# EAGLE design io_dac_convert (EAGLE 7.7.0)
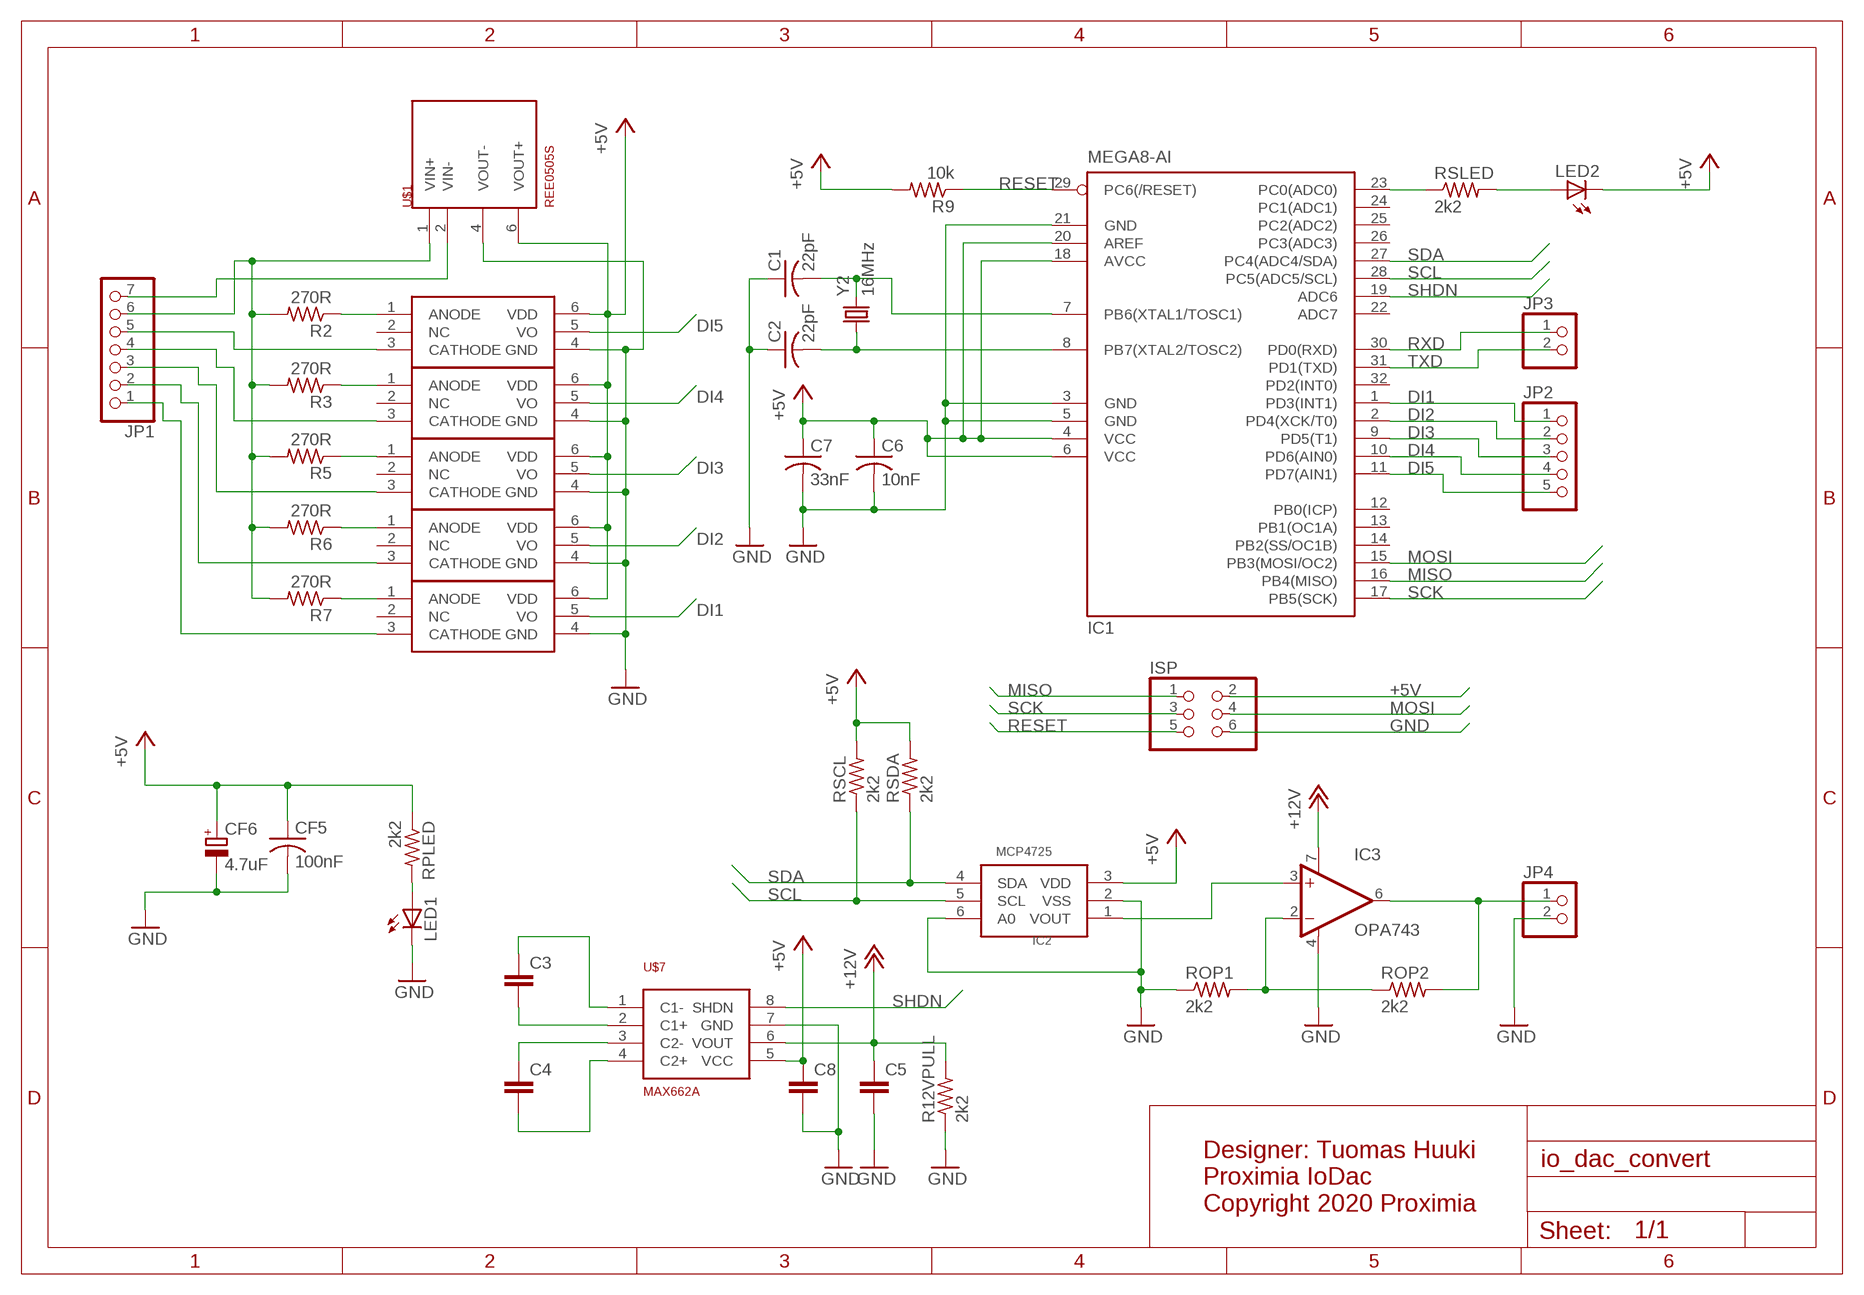
[diagram p0: schematic, sheet 1]

## Parts
C1  22pF  C-USC0603  [C0603]
C2  22pF  C-USC0603  [C0603]
C3  C-EUC1206  [C1206]
C4  C-EUC1206  [C1206]
C5  C-EUC1206  [C1206]
C6  10nF  C-USC0603  [C0603]
C7  33nF  C-USC0603  [C0603]
C8  C-EUC1206  [C1206]
CF5  100nF  C-USC0603  [C0603]
CF6  4.7uF  CPOL-EUB  [PANASONIC_B]
IC1  MEGA8-AI  [TQFP32-08]
IC2  MCP4725  [SOT23-6]
IC3  OPA743  OPA658U  [SO08]
ISP  PINHD-2X3  [2X03]
JP1  PINHD-1X7  [1X07]
JP2  PINHD-1X5  [1X05]
JP3  PINHD-1X2  [1X02]
JP4  PINHD-1X2  [1X02]
LED1  LEDSML1206  [SML1206]
LED2  LEDSML1206  [SML1206]
R2  270R  R-US_R0603  [R0603]
R3  270R  R-US_R0603  [R0603]
R5  270R  R-US_R0603  [R0603]
R6  270R  R-US_R0603  [R0603]
R7  270R  R-US_R0603  [R0603]
R9  10k  R-US_R0603  [R0603]
R12VPULL  2k2  R-US_R0603  [R0603]
ROP1  2k2  R-US_R0603  [R0603]
ROP2  2k2  R-US_R0603  [R0603]
RPLED  2k2  R-US_R0603  [R0603]
RSCL  2k2  R-US_R0603  [R0603]
RSDA  2k2  R-US_R0603  [R0603]
RSLED  2k2  R-US_R0603  [R0603]
U$1  REE0505S  [SIP-6]
U$2  SI8710  [SDIP-6]
U$3  SI8710  [SDIP-6]
U$4  SI8710  [SDIP-6]
U$5  SI8710  [SDIP-6]
U$6  SI8710  [SDIP-6]
U$7  MAX662A  [SO8]
Y2  16MHz  CRYSTAL5X3  [CRYSTAL-SMD-5X3]

## Nets
+5V: C6.1 C7.1 C8.1 CF5.1 CF6.+ IC1.4(VCC) IC1.6(VCC) IC1.18(AVCC) IC1.20(AREF) IC2.3(VDD) ISP.2 LED2.C R9.2 RPLED.1 RSCL.2 RSDA.2 U$1.6(VOUT+) U$2.6(VDD) U$3.6(VDD) U$4.6(VDD) U$5.6(VDD) U$6.6(VDD) U$7.5(VCC)
+12V: C5.1 IC3.7(V+) R12VPULL.2 U$7.6(VOUT)
DI1: IC1.1(PD3(INT1)) JP2.1 U$6.5(VO)
DI2: IC1.2(PD4(XCK/T0)) JP2.2 U$5.5(VO)
DI3: IC1.9(PD5(T1)) JP2.3 U$4.5(VO)
DI4: IC1.10(PD6(AIN0)) JP2.4 U$3.5(VO)
DI5: IC1.11(PD7(AIN1)) JP2.5 U$2.5(VO)
GND: C1.1 C2.1 C5.2 C6.2 C7.2 C8.2 CF5.2 CF6.- IC1.3(GND) IC1.5(GND) IC1.21(GND) IC2.2(VSS) IC2.6(A0) IC3.4(V-) ISP.6 JP4.2 LED1.C R12VPULL.1 ROP1.1 U$1.4(VOUT-) U$2.4(GND) U$3.4(GND) U$4.4(GND) U$5.4(GND) U$6.4(GND) U$7.7(GND)
GND_EXT: JP1.7 U$1.2(VIN-)
MISO: IC1.16(PB4(MISO)) ISP.1
MOSI: IC1.15(PB3(MOSI/OC2)) ISP.4
N$1: LED1.A RPLED.2
N$3: IC1.23(PC0(ADC0)) RSLED.1
N$4: JP1.6 R2.2 R3.2 R5.2 R6.2 R7.2 U$1.1(VIN+)
N$5: R2.1 U$2.1(ANODE)
N$6: JP1.5 U$2.3(CATHODE)
N$7: R3.1 U$3.1(ANODE)
N$8: R5.1 U$4.1(ANODE)
N$9: R6.1 U$5.1(ANODE)
N$10: R7.1 U$6.1(ANODE)
N$11: JP1.4 U$3.3(CATHODE)
N$12: JP1.3 U$4.3(CATHODE)
N$13: JP1.2 U$5.3(CATHODE)
N$14: JP1.1 U$6.3(CATHODE)
N$15: C2.2 IC1.8(PB7(XTAL2/TOSC2)) Y2.1
N$16: C1.2 IC1.7(PB6(XTAL1/TOSC1)) Y2.3
N$17: C3.2 U$7.2(C1+)
N$18: IC2.1(VOUT) IC3.3(+IN)
N$19: IC3.6(OUT) JP4.1 ROP2.2
N$20: IC3.2(-IN) ROP1.2 ROP2.1
N$21: C3.1 U$7.1(C1-)
N$22: LED2.A RSLED.2
N$23: C4.1 U$7.3(C2-)
N$24: C4.2 U$7.4(C2+)
RESET: IC1.29(PC6(/RESET)) ISP.5 R9.1
RXD: IC1.30(PD0(RXD)) JP3.1
SCK: IC1.17(PB5(SCK)) ISP.3
SCL: IC1.28(PC5(ADC5/SCL)) IC2.5(SCL) RSCL.1
SDA: IC1.27(PC4(ADC4/SDA)) IC2.4(SDA) RSDA.1
SHDN: IC1.19(ADC6) U$7.8(SHDN)
TXD: IC1.31(PD1(TXD)) JP3.2
Unconnected: IC1.12(PB0(ICP)) IC1.13(PB1(OC1A)) IC1.14(PB2(SS/OC1B)) IC1.22(ADC7) IC1.24(PC1(ADC1)) IC1.25(PC2(ADC2)) IC1.26(PC3(ADC3)) IC1.32(PD2(INT0)) U$2.2(NC) U$3.2(NC) U$4.2(NC) U$5.2(NC) U$6.2(NC)

## Notes on the sheet
- Designer: Tuomas Huuki 
  Proximia IoDac
  Copyright 2020 Proximia

## Library data of the parts
C1 C2 CF5 = rcl:C-US: CAPACITOR, American symbol
C3-C5 C8 = rcl:C-EU: CAPACITOR, European symbol
C6 C7 = resistor:C-US: CAPACITOR, American symbol
CF6 = resistor:CPOL-EU: POLARIZED CAPACITOR, European symbol
IC1 = atmel:MEGA8: MICROCONTROLLER 8 Kbytes FLASH, 1 kbytes SRAM, 512 bytes EEPROM, USART, 6-channel 10 bit ADC, 2-channel 8 bit ADC Pin compatible with Atmega48, ATMega88, ATMega168 Source: avr.lbr; MPN: ATMEGA8-16AU; OC_FARNELL: 9171371; OC_NEWARK: 73M8863
IC2 = microchip-update:MCP4725: 12-Bit Digital-to-Analog Converter with EEPROM Memory in SOT-23-6
IC3 = burr-brown:OPA658: Operational Amplifier Wideband, Low Power, Current Feedback; MPN: AD8001ARZ; OC_FARNELL: unknown; OC_NEWARK: 19M0912
ISP = pinhead:PINHD-2X3: PIN HEADER
JP1 = pinhead:PINHD-1X7: PIN HEADER
JP2 = pinhead:PINHD-1X5: PIN HEADER
JP3 JP4 = pinhead:PINHD-1X2: PIN HEADER
LED1 LED2 = led:LED: LED OSRAM: - CHIPLED LG R971, LG N971, LY N971, LG Q971, LY Q971, LO R971, LY R971 LH N974, LH R974 LS Q976, LO Q976, LY Q976 LO Q996 - Hyper CHIPLED LW Q18S LB Q993, LB Q99A, LB R99A - SideLED LS A670, LO A670, LY A670, LG A670, LP A670 LB A673, LV A673, LT A673, LW A673 LH A674 LY A675 LS A676, LA A676, LO A676, LY A676, LW A676 LS A679, LY A679, LG A679 - Hyper Micro SIDELED® LS Y876, LA Y876, LO Y876, LY Y876 LT Y87S - SmartLED LW L88C, LW L88S LB L89C, LB L89S, LG L890 LS L89K, LO L89K, LY L89K LS L896, LA L896, LO L896, LY L896 - TOPLED LS T670, LO T670, LY T670, LG T670, LP T670 LSG T670, LSP T670, LSY T670, LOP T670, LYG T670 LG T671, LOG T671, LSG T671 LB T673, LV T673, LT T673, LW T673 LH T674 LS T676, LA T676, LO T676, LY T676, LB T676, LH T676, LSB T676, LW T676 LB T67C, LV T67C, LT T67C, LS T67K, LO T67K, LY T67K, LW E67C LS E67B, LA E67B, LO E67B, LY E67B, LB E67C, LV E67C, LT E67C LW T67C LS T679, LY T679, LG T679 LS T770, LO T770, LY T770, LG T770, LP T770 LB T773, LV T773, LT T773, LW T773 LH T774 LS E675, LA E675, LY E675, LS T675 LS T776, LA T776, LO T776, LY T776, LB T776 LHGB T686 LT T68C, LB T68C - Hyper Mini TOPLED® LB M676 - Mini TOPLED Santana® LG M470 LS M47K, LO M47K, LY M47K Source: http://www.osram.convergy.de LUXEON: - LUMILED® LXK2-PW12-R00, LXK2-PW12-S00, LXK2-PW14-U00, LXK2-PW14-V00 LXK2-PM12-R00, LXK2-PM12-S00, LXK2-PM14-U00 LXK2-PE12-Q00, LXK2-PE12-R00, LXK2-PE12-S00, LXK2-PE14-T00, LXK2-PE14-U00 LXK2-PB12-K00, LXK2-PB12-L00, LXK2-PB12-M00, LXK2-PB14-N00, LXK2-PB14-P00, LXK2-PB14-Q00 LXK2-PR12-L00, LXK2-PR12-M00, LXK2-PR14-Q00, LXK2-PR14-R00 LXK2-PD12-Q00, LXK2-PD12-R00, LXK2-PD12-S00 LXK2-PH12-R00, LXK2-PH12-S00 LXK2-PL12-P00, LXK2-PL12-Q00, LXK2-PL12-R00 Source: www.luxeon.com KINGBRIGHT: KA-3528ASYC Source: www.kingbright.com
R2 R3 R5-R7 R12VPULL ROP1 ROP2 RPLED RSCL RSDA RSLED = rcl:R-US_: RESISTOR, American symbol
R9 = resistor:R-US_: RESISTOR, American symbol
U$1 = REE:REE0505S
U$2-U$6 = REE:SI8710
U$7 = REE:MAX662A
Y2 = SparkFun-FreqCtrl:CRYSTAL: Various standard crystals. Proven footprints. Spark Fun Electronics SKU : COM-00534

## Board
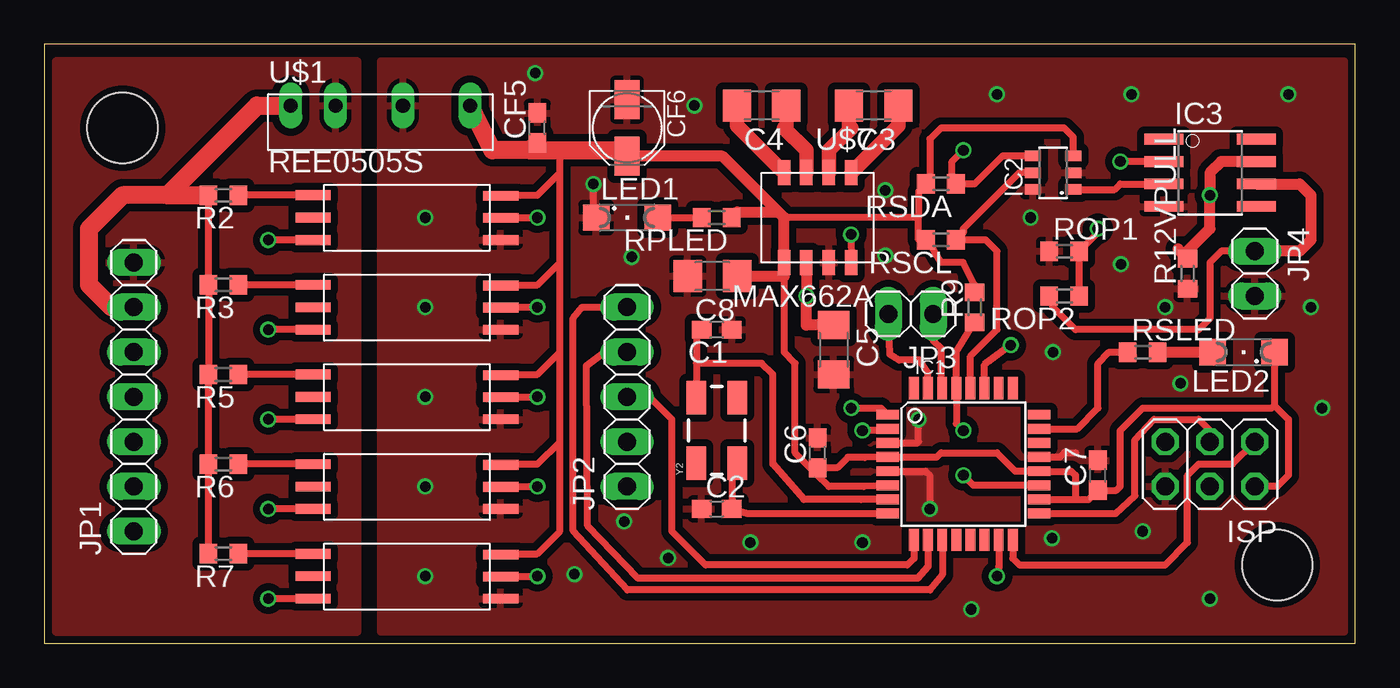
[diagram p1: board, top side]
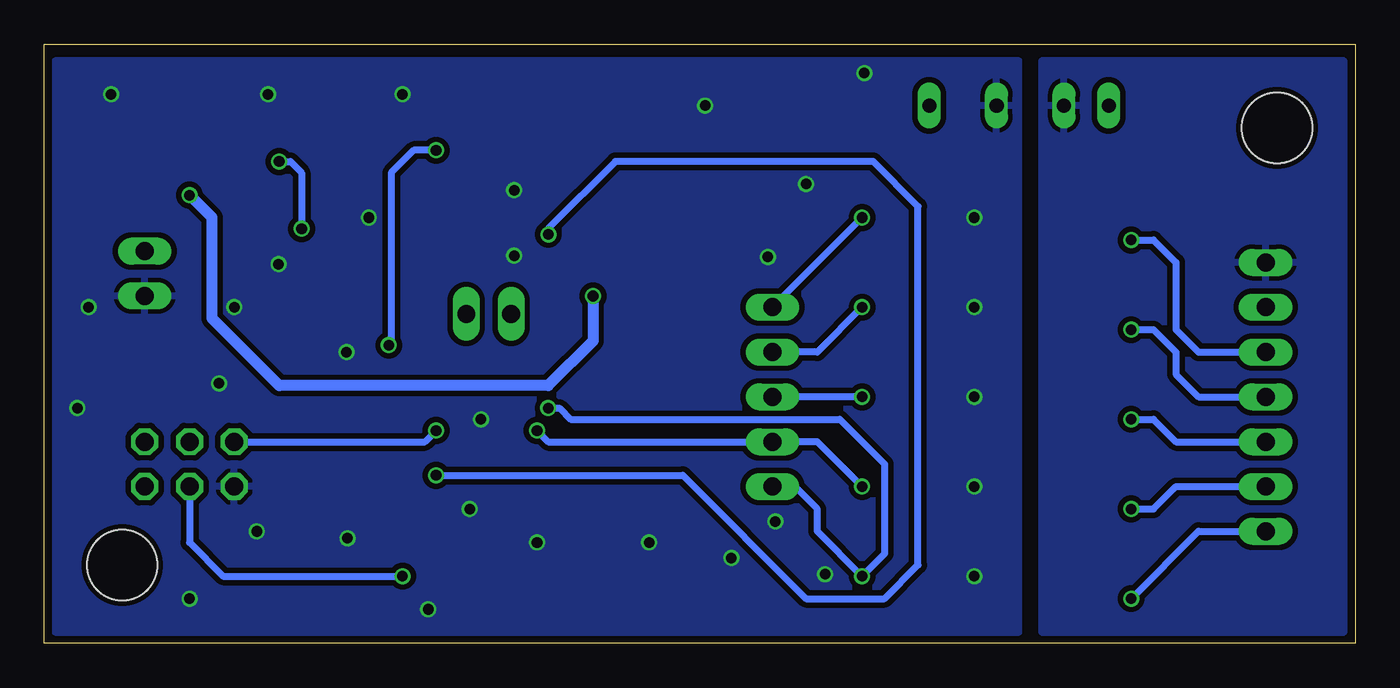
[diagram p2: board, bottom side, seen from below]

Size 74.28 x 33.96 mm. Coordinates in mm from the lower left corner, seen from the top.
Outline: 0,0 74.28,0 74.28,33.96 0,33.96 0,0
Copper layers (1*16): Top 0.035mm / dielectric 1.5mm / Bottom 0.035mm
Design rules "ITeadstudio": minimum track width 6mil, minimum drill 12mil, track to track 6mil, track to pad 6mil, pad to pad 6mil, via to via 6mil, smd to smd 0mil, copper to edge 10mil, drill to drill 10mil, minimum pad ring 10mil, minimum via ring 6mil, stop-mask expansion 2mil, vias tented up to drill 100mil, thermal gap 10mil
Holes 4 mm at 4.45,29.21 69.85,4.45

### Footprints (pad centres in the part's own frame; a part is rotated, then mirrored left to right if it is on the bottom)
C0603 = smd 1.1 x 1: 1 -0.85,0; 2 0.85,0
C1206 = smd 1.6 x 1.8: 1 -1.4,0; 2 1.4,0
PANASONIC_B = smd 2.2 x 1.4: + 1.6,0; - -1.6,0
TQFP32-08 = smd 1.27 x 0.559: 1 -4.293,2.8; 2 -4.293,2; 3 -4.293,1.2; 4 -4.293,0.4; 5 -4.293,-0.4; 6 -4.293,-1.2; 7 -4.293,-2; 8 -4.293,-2.8; 17 4.293,-2.8; 18 4.293,-2; 19 4.293,-1.2; 20 4.293,-0.4; 21 4.293,0.4; 22 4.293,1.2; 23 4.293,2; 24 4.293,2.8 | smd 0.559 x 1.27: 9 -2.8,-4.293; 10 -2,-4.293; 11 -1.2,-4.293; 12 -0.4,-4.293; 13 0.4,-4.293; 14 1.2,-4.293; 15 2,-4.293; 16 2.8,-4.293; 25 2.8,4.293; 26 2,4.293; 27 1.2,4.293; 28 0.4,4.293; 29 -0.4,4.293; 30 -1.2,4.293; 31 -2,4.293; 32 -2.8,4.293
SOT23-6 = smd 0.6 x 0.9: 1 -0.95,-1.15; 2 0,-1.15; 3 0.95,-1.15; 4 0.95,1.15; 5 0,1.15; 6 -0.95,1.15
SO08 = smd 0.61 x 2.21: 1 -1.905,-2.616; 2 -0.635,-2.616; 3 0.635,-2.616; 4 1.905,-2.616; 5 1.905,2.616; 6 0.635,2.616; 7 -0.635,2.616; 8 -1.905,2.616
2X03 = drill 1.016 octagon: 1 -2.54,-1.27; 2 -2.54,1.27; 3 0,-1.27; 4 0,1.27; 5 2.54,-1.27; 6 2.54,1.27
1X07 = drill 1.016 long: 1 -7.62,0; 2 -5.08,0; 3 -2.54,0; 4 0,0; 5 2.54,0; 6 5.08,0; 7 7.62,0
1X05 = drill 1.016 long: 1 -5.08,0; 2 -2.54,0; 3 0,0; 4 2.54,0; 5 5.08,0
1X02 = drill 1.016 long: 1 -1.27,0; 2 1.27,0
SML1206 = smd 1.5 x 1.5: A 1.75,0; C -1.75,0
R0603 = smd 1 x 1.1: 1 -0.85,0; 2 0.85,0
SIP-6 = drill 0.8 long: 1 0,0; 2 2.54,0; 4 6.35,0; 6 10.16,0
SDIP-6 = smd 2 x 0.55: 1 0,2.54; 2 0,1.27; 3 0,0; 4 10.625,0; 5 10.625,1.25; 6 10.625,2.5
SO8 = smd 0.711 x 1.422: 1 0,0; 2 1.27,0; 3 2.54,0; 4 3.81,0; 5 3.81,5.08; 6 2.54,5.08; 7 1.27,5.08; 8 0,5.08
CRYSTAL-SMD-5X3 = smd 1.9 x 1.1: 1 -1.85,-1.15; 2 1.85,-1.15; 3 1.85,1.15; 4 -1.85,1.15

### Placement (x,y rotation side)
C1  38.1,17.78 180 top
C2  38.1,7.62 0 top
C3  46.99,30.48 180 top
C4  40.64,30.48 180 top
C5  44.72,16.64 270 top
C6  43.81,10.79 90 top
C7  59.69,9.53 90 top
C8  37.85,20.81 180 top
CF5  27.94,29.21 90 top
CF6  33.02,29.21 270 top
IC1  52.07,10.16 0 top
IC2  57.15,26.67 90 top
IC3  66.04,26.67 270 top
ISP  66.04,10.16 180 top
JP1  5.08,13.97 90 top
JP2  33.02,13.97 90 top
JP3  49.09,18.68 180 top
JP4  68.58,20.95 270 top
LED1  33.02,24.13 0 top
LED2  67.94,16.51 180 top
R2  10.16,25.4 180 top
R3  10.16,20.32 180 top
R5  10.16,15.24 180 top
R6  10.16,10.16 180 top
R7  10.16,5.08 180 top
R9  52.7,19.05 90 top
R12VPULL  64.77,20.95 90 top
ROP1  57.78,22.23 0 top
ROP2  57.78,19.68 180 top
RPLED  38.1,24.13 180 top
RSCL  50.8,22.86 180 top
RSDA  50.8,26.04 180 top
RSLED  62.23,16.51 0 top
U$1  13.97,30.48 0 top
U$2  15.24,22.86 0 top
U$3  15.24,17.78 0 top
U$4  15.24,12.7 0 top
U$5  15.24,7.62 0 top
U$6  15.24,2.54 0 top
U$7  45.72,26.67 180 top
Y2  38.1,12.06 90 top

### Tracks (layer width: path | path; a pad name or v marks a point on that pad's centre or on a via)
+5V
  Top 0.406: 29.21,26.67 27.94,25.4 25.91,25.4 U$2.6 | 29.21,26.67 29.21,27.94 | U$3.6 25.91,20.32 27.94,20.32 29.21,21.59 | 29.21,21.59 29.21,26.67 | U$4.6 25.91,15.24 27.94,15.24 29.21,16.51 | 29.21,16.51 29.21,21.59 | U$5.6 25.91,10.16 27.94,10.16 29.21,11.43 | 29.21,11.43 29.21,16.51 | U$6.6 25.91,5.08 27.94,5.08 29.21,6.35 29.21,11.43 | 49.53,24.13 49.53,25.61 RSDA.2 50.16,26.25 50.16,28.57 50.8,29.21 57.78,29.21 58.3,28.7 IC2.3 | 50.16,22.86 RSCL.2 | RSCL.2 49.53,22.86 49.53,24.13 | 49.53,24.13 41.91,24.13 | 43.81,9.53 C6.1 | IC1.6 46.44,8.89 44.45,8.89 43.81,9.53 | 43.81,10.16 C6.1 | 43.81,9.53 42.55,10.79 42.55,15.88 41.91,16.51 U$7.5 | C6.1 44.94,9.96 45.53,10.55 46.49,10.54 IC1.4 50.56,10.56 50.8,10.79 53.98,10.79 55.01,9.76 IC1.20 58.19,9.76 58.42,9.53 58.42,8.16 | R9.2 52.7,20.32 52.07,21.59 50.8,21.59 50.16,22.64 RSCL.2 | IC1.18 58.42,8.16 | 58.42,8.16 59.17,8.16 C7.1 60.74,8.68 60.96,8.89 60.96,12.06 62.23,13.34 69.54,13.34 69.69,13.49 | LED2.C 69.69,13.49 | 69.69,13.49 70.48,12.7 70.48,9.53 69.85,8.89 ISP.2
  Top 0.61: 41.59,24.45 41.91,24.13 U$7.5 41.91,20.81 C8.1 | 41.59,24.45 38.43,27.61 CF6.+ | RPLED.1 39.27,24.45 41.59,24.45
  Top 1.016: CF5.1 27.52,27.94 | 27.52,27.94 25.4,27.94 U$1.6 | 27.52,27.94 29.21,27.94 33.02,27.94 CF6.+
+12V  (via drill 0.6)
  Top 0.61: U$7.6 v43.18,19.68 43.18,18.04 C5.1 | IC3.7 66.67,27.3 66.04,26.67 v66.04,25.4 66.04,23.5 64.77,22.23 R12VPULL.2 64.22,22.36
  Bottom 0.61: v43.18,19.68 43.18,17.14 45.72,14.61 60.96,14.61 64.77,18.41 64.77,24.13 v66.04,25.4
DI1  (via drill 0.6)
  Top 0.406: U$6.5 25.89,3.81 v27.94,3.81 | v45.72,13.34 47.4,13.34 IC1.1
  Bottom 0.406: JP2.1 31.75,8.89 30.48,7.62 30.48,6.35 v27.94,3.81 26.67,5.08 26.67,10.16 29.21,12.7 44.45,12.7 45.09,13.34 v45.72,13.34
DI2  (via drill 0.6)
  Top 0.406: U$5.5 25.89,8.89 v27.94,8.89 | IC1.2 47.68,12.06 v46.35,12.06
  Bottom 0.406: v27.94,8.89 30.48,11.43 JP2.2 45.72,11.43 v46.35,12.06
DI3  (via drill 0.6)
  Top 0.406: U$4.5 25.89,13.97 v27.94,13.97 | JP2.3 34.29,13.97 35.56,12.7 35.56,6.35 37.47,4.45 48.9,4.45 49.27,4.82 IC1.9
  Bottom 0.406: v27.94,13.97 JP2.3
DI4  (via drill 0.6)
  Top 0.406: U$3.5 25.89,19.05 v27.94,19.05 | IC1.10 50.07,4.35 49.51,3.69 33.63,3.69 30.8,6.67 30.71,15.74 31.75,16.51 JP2.4
  Bottom 0.406: v27.94,19.05 30.48,16.51 JP2.4
DI5  (via drill 0.6)
  Top 0.406: U$2.5 25.89,24.13 v27.94,24.13 | IC1.11 50.87,3.88 50.19,3.03 33.04,3.03 29.97,6.37 29.97,18.44 30.48,19.05 JP2.5
  Bottom 0.406: v27.94,24.13 JP2.5
GND  (via drill 0.6)
  Top 0.406: LED1.C 31.11,24.29 v31.11,26.04 | IC1.3 49.46,11.36 49.53,11.43 v49.53,12.7 | IC1.5 49.93,9.76 50.16,9.53 v50.16,7.62 | IC1.21 57.55,10.56 57.78,10.79 58.42,10.79
  other vias: 46.35,5.71 40.01,5.71 57.15,16.51 55.88,24.13 71.75,19.05 72.39,13.34 62.23,6.35 66.04,2.54 61.59,31.11 53.98,31.11 70.48,31.11 36.83,30.48 21.59,24.13 21.59,19.05 21.59,13.97 21.59,8.89 21.59,3.81 63.5,19.05 47.65,25.68 47.65,21.97 33.28,21.9 32.85,6.9 35.35,4.84 30.04,3.92 52.51,1.93 57.1,5.96 64.37,14.74 27.82,32.33 61,21.49
  pour Top (isolate 0.406): 19.05,33.02 73.66,33.02 73.66,0.64 19.05,0.64 19.05,32.38
  pour Bottom (isolate 0.305): 19.05,33.02 73.66,33.02 73.66,0.64 19.05,0.64
GND_EXT
  pour Top (isolate 0.406): 17.78,33.02 0.64,33.02 0.64,0.64 17.78,0.64
  pour Bottom (isolate 0.305): 0.64,33.02 17.78,33.02 17.78,0.64 0.64,0.64
MISO
  Top 0.406: IC1.16 54.87,4.82 55.24,4.45 63.5,4.45 64.77,5.71 64.77,9.53 65.41,10.16 67.31,10.16 ISP.1
MOSI  (via drill 0.6)
  Top 0.406: IC1.15 54.07,4.35 v53.98,3.81
  Bottom 0.406: ISP.4 66.04,5.71 64.14,3.81 v53.98,3.81
N$1
  Top 0.406: LED1.A RPLED.2
N$3
  Top 0.406: IC1.23 58.52,12.16 59.69,13.34 59.69,15.88 60.33,16.51 RSLED.1
  Top 0.61: 61.59,16.3 RSLED.1
N$4
  Top 0.406: R7.2 R6.2 R5.2 R3.2 R2.2
  Top 1.016: JP1.6 3.81,19.05 2.54,20.32 2.54,23.5 4.45,25.4 6.99,25.4 | 6.99,25.4 12.06,30.48 U$1.1 | 6.99,25.4 R2.2
N$5
  Top 0.406: U$2.1 R2.1
N$6  (via drill 0.6)
  Top 0.406: U$2.3 v12.7,22.86
  Bottom 0.406: v12.7,22.86 11.43,22.86 10.16,21.59 10.16,17.78 8.89,16.51 JP1.5
N$7
  Top 0.406: U$3.1 R3.1
N$8
  Top 0.406: U$4.1 R5.1
N$9
  Top 0.406: U$5.1 R6.1
N$10
  Top 0.406: U$6.1 R7.1
N$11  (via drill 0.6)
  Top 0.406: U$3.3 v12.7,17.78
  Bottom 0.406: v12.7,17.78 11.43,17.78 10.16,16.51 10.16,15.24 8.89,13.97 JP1.4
N$12  (via drill 0.6)
  Top 0.406: U$4.3 v12.7,12.7
  Bottom 0.406: v12.7,12.7 11.43,12.7 10.16,11.43 JP1.3
N$13  (via drill 0.6)
  Top 0.406: U$5.3 v12.7,7.62
  Bottom 0.406: v12.7,7.62 11.43,7.62 10.16,8.89 JP1.2
N$14  (via drill 0.6)
  Top 0.406: U$6.3 v12.7,2.54
  Bottom 0.406: v12.7,2.54 8.89,6.35 JP1.1
N$15
  Top 0.406: Y2.1 38.95,9.91 C2.2 39.84,7.36 IC1.8
N$16
  Top 0.406: C1.2 36.95,17.48 36.95,15.88 | 36.95,15.88 Y2.3 | IC1.7 46.27,8.15 43.04,8.15 41.27,10.16 41.27,15.24 40.64,15.88 36.95,15.88
N$17
  Top 0.813: U$7.2 44.45,27.94 45.72,29.21 45.59,29.34 C3.2
N$18
  Top 0.406: IC2.1 60.65,25.72 60.96,26.04 IC3.3
N$19
  Top 0.406: JP4.1 66.67,22.23 66.04,21.59 66.04,18.41 65.41,17.78 58.42,17.78 57.15,19.05 57.15,19.47 ROP2.2
  Top 0.61: IC3.6 71.12,26.04 71.75,25.4 71.75,22.86 71.12,22.23 JP4.1
N$20  (via drill 0.6)
  Top 0.406: IC3.2 v60.96,27.3 | v59.69,23.5 59.69,23.28 ROP1.2 ROP2.1
  Bottom 0.406: v60.96,27.3 60.33,27.3 59.69,26.67 v59.69,23.5
N$21
  Top 0.813: U$7.1 48.39,29.34 C3.1
N$22
  Top 0.61: RSLED.2 LED2.A
N$23
  Top 0.813: U$7.3 43.18,27.94 41.91,29.21 42.04,29.34 C4.1
N$24
  Top 0.813: U$7.4 39.24,29.34 C4.2
RESET  (via drill 0.6)
  Top 0.406: R9.1 51.67,16.53 IC1.29 51.67,12.46 v52.07,12.06
  Bottom 0.406: ISP.5 52.7,11.43 v52.07,12.06
RXD
  Top 0.406: IC1.30 50.83,14.45 50.83,16.7 50.36,17.18 JP3.1
SCK
  Top 0.406: IC1.17 60.7,7.36 61.79,8.37 61.79,11.54 62.87,12.7 65.41,12.7 66.04,12.06 ISP.3
SCL
  Top 0.406: IC2.5 55.24,26.67 52.07,23.5 52.07,23.28 RSCL.1 53.34,22.86 53.98,22.23 53.98,17.78 52.47,16.27 IC1.28
SDA  (via drill 0.6)
  Top 0.406: IC2.4 54.29,27.62 52.7,26.04 RSDA.1 51.44,26.04 51.44,27.3 v52.07,27.94 | v54.75,16.9 53.27,15.8 IC1.27
  Bottom 0.406: v52.07,27.94 53.34,27.94 54.61,26.67 54.61,17.14 v54.75,16.9
SHDN  (via drill 0.6)
  Top 0.406: IC1.19 52.63,8.96 v52.07,9.53 | v45.71,23.18 U$7.8
  Bottom 0.406: v52.07,9.53 38.1,9.53 31.11,2.54 26.67,2.54 24.77,4.45 24.77,24.77 27.3,27.3 41.91,27.3 45.72,23.5 v45.71,23.18
TXD
  Top 0.406: IC1.31 50.07,15.34 49.58,16.07 48.42,16.05 47.91,16.39 JP3.2

### Text on the board
tDocu: - + | 1 2 3 4 5 + - | PROG
bDocu: Proximia IoDAC / (c) 2020 Tuomas Huuki